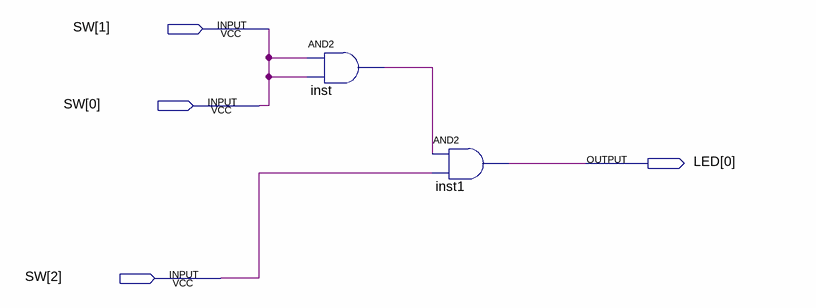
[diagram p0: schematic sheet]
// Quartus schematic Fpga.bdf as structural Verilog: 2 symbols, 4 pins
module Fpga (
  input  [2:0] SW,
  output [0:0] LED
);

  wire inst_out;

  and inst (inst_out, SW[1], SW[1]);
  and inst1 (LED[0], inst_out, SW[2]);

  assign SW[0] = SW[1];
endmodule
